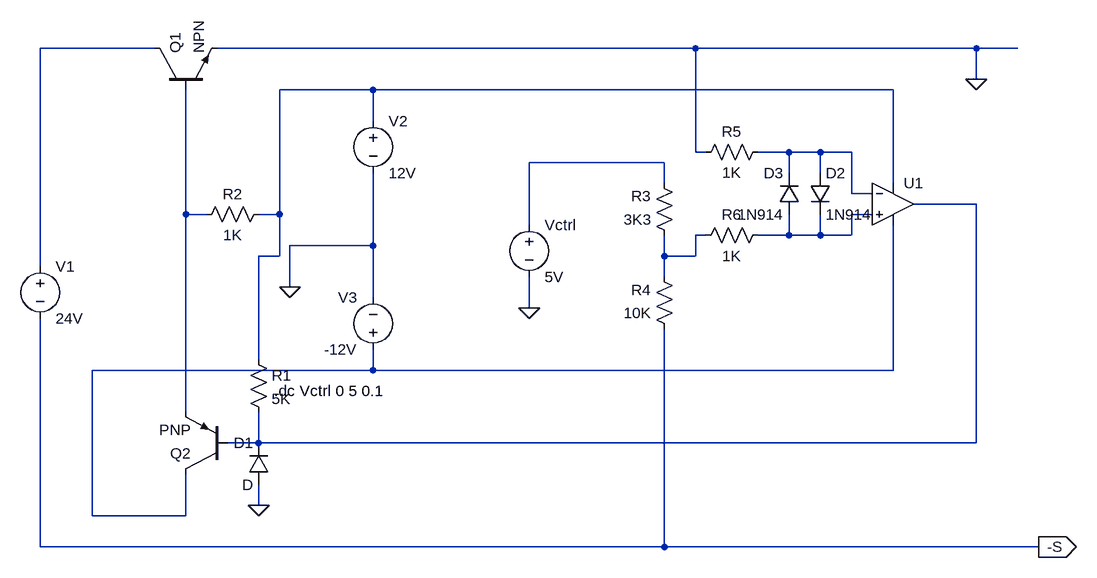
[diagram p0: schematic v-set.asc]
v-set.asc, the LTspice schematic file:
Version 4
SHEET 1 880 744
WIRE -912 -96 -1088 -96
WIRE -80 -96 -816 -96
WIRE 352 -96 -80 -96
WIRE 416 -96 352 -96
WIRE 352 -48 352 -96
WIRE -576 -32 -720 -32
WIRE 224 -32 -576 -32
WIRE -576 16 -576 -32
WIRE -80 64 -80 -96
WIRE -64 64 -80 64
WIRE 64 64 16 64
WIRE 112 64 64 64
WIRE 160 64 112 64
WIRE -128 80 -336 80
WIRE 64 96 64 64
WIRE 112 96 112 64
WIRE -128 112 -128 80
WIRE 224 112 224 -32
WIRE 160 128 160 64
WIRE 192 128 160 128
WIRE 352 144 256 144
WIRE -864 160 -864 -32
WIRE -832 160 -864 160
WIRE -720 160 -720 -32
WIRE -720 160 -752 160
WIRE 192 160 160 160
WIRE -336 176 -336 80
WIRE -64 192 -80 192
WIRE 64 192 64 160
WIRE 64 192 16 192
WIRE 112 192 112 160
WIRE 112 192 64 192
WIRE 160 192 160 160
WIRE 160 192 112 192
WIRE -576 208 -576 96
WIRE -576 208 -704 208
WIRE -720 224 -720 160
WIRE -720 224 -752 224
WIRE -128 224 -128 192
WIRE -80 224 -80 192
WIRE -80 224 -128 224
WIRE -1088 240 -1088 -96
WIRE -128 256 -128 224
WIRE -704 272 -704 208
WIRE -576 288 -576 208
WIRE -336 304 -336 256
WIRE -752 384 -752 224
WIRE -576 400 -576 368
WIRE -576 400 -1008 400
WIRE 224 400 224 176
WIRE 224 400 -576 400
WIRE -864 464 -864 160
WIRE -752 512 -752 464
WIRE -752 512 -800 512
WIRE 352 512 352 144
WIRE 352 512 -752 512
WIRE -752 608 -752 576
WIRE -1008 624 -1008 400
WIRE -864 624 -864 560
WIRE -864 624 -1008 624
WIRE -1088 672 -1088 320
WIRE -128 672 -128 336
WIRE -128 672 -1088 672
WIRE 448 672 -128 672
FLAG 352 -48 0
FLAG -704 272 0
FLAG -336 304 0
FLAG 448 672 -S
IOPIN 448 672 Out
FLAG -752 608 0
SYMBOL Opamps\\UniversalOpamp2 224 144 R0
SYMATTR InstName U1
SYMBOL res -112 208 R180
WINDOW 0 36 76 Left 2
WINDOW 3 36 40 Left 2
SYMATTR InstName R3
SYMATTR Value 3K3
SYMBOL res -112 352 R180
WINDOW 0 36 76 Left 2
WINDOW 3 36 40 Left 2
SYMATTR InstName R4
SYMATTR Value 10K
SYMBOL voltage -336 160 R0
SYMATTR InstName Vctrl
SYMATTR Value 5V
SYMBOL voltage -576 0 R0
SYMATTR InstName V2
SYMATTR Value 12V
SYMBOL voltage -576 384 R180
WINDOW 0 24 96 Left 2
WINDOW 3 24 16 Left 2
SYMATTR InstName V3
SYMATTR Value -12V
SYMBOL voltage -1088 224 R0
SYMATTR InstName V1
SYMATTR Value 24V
SYMBOL npn -912 -32 R270
SYMATTR InstName Q1
SYMBOL pnp -800 560 R180
SYMATTR InstName Q2
SYMBOL res -768 368 R0
SYMATTR InstName R1
SYMATTR Value 5K
SYMBOL res -736 144 R90
WINDOW 0 0 56 VBottom 2
WINDOW 3 32 56 VTop 2
SYMATTR InstName R2
SYMATTR Value 1K
SYMBOL diode -736 576 R180
WINDOW 0 24 64 Left 2
WINDOW 3 24 0 Left 2
SYMATTR InstName D1
SYMBOL res 32 48 R90
WINDOW 0 0 56 VBottom 2
WINDOW 3 32 56 VTop 2
SYMATTR InstName R5
SYMATTR Value 1K
SYMBOL res 32 176 R90
WINDOW 0 0 56 VBottom 2
WINDOW 3 32 56 VTop 2
SYMATTR InstName R6
SYMATTR Value 1K
SYMBOL diode 80 160 R180
WINDOW 0 24 64 Left 2
WINDOW 3 24 0 Left 2
SYMATTR InstName D3
SYMATTR Value 1N914
SYMBOL diode 96 96 R0
SYMATTR InstName D2
SYMATTR Value 1N914
TEXT -728 432 Left 2 !.dc Vctrl 0 5 0.1

The netlist it stands for:
* v-set.asc
XU1 N007 N003 N002 N009 N005 level.2 Avol=1Meg GBW=10Meg Slew=10Meg ilimit=25m rail=0 Vos=0 phimargin=45 en=0 enk=0 in=0 ink=0 Rin=500Meg  ; pins IN+ IN- V+ V- OUT
R3 N008 N004 3K3
R4 -S N008 10K
Vctrl N004 0 5V
V2 N002 0 12V
V3 N009 0 -12V
V1 N001 -S 24V
Q1 N001 N006 0 0 NPN
Q2 N009 N005 N006 0 PNP
R1 N002 N005 5K
R2 N002 N006 1K
D1 0 N005 D
R5 N003 0 1K
R6 N007 N008 1K
D3 N007 N003 1N914
D2 N003 N007 1N914
.model D D
.lib standard.dio
.model NPN NPN
.model PNP PNP
.lib standard.bjt
.dc Vctrl 0 5 0.1
.lib UniversalOpamps2.sub
.backanno
.end